# EAGLE schematic Tesla Coil (EAGLE 9.2.1)

## Sheet 1 of 3: Interrupter
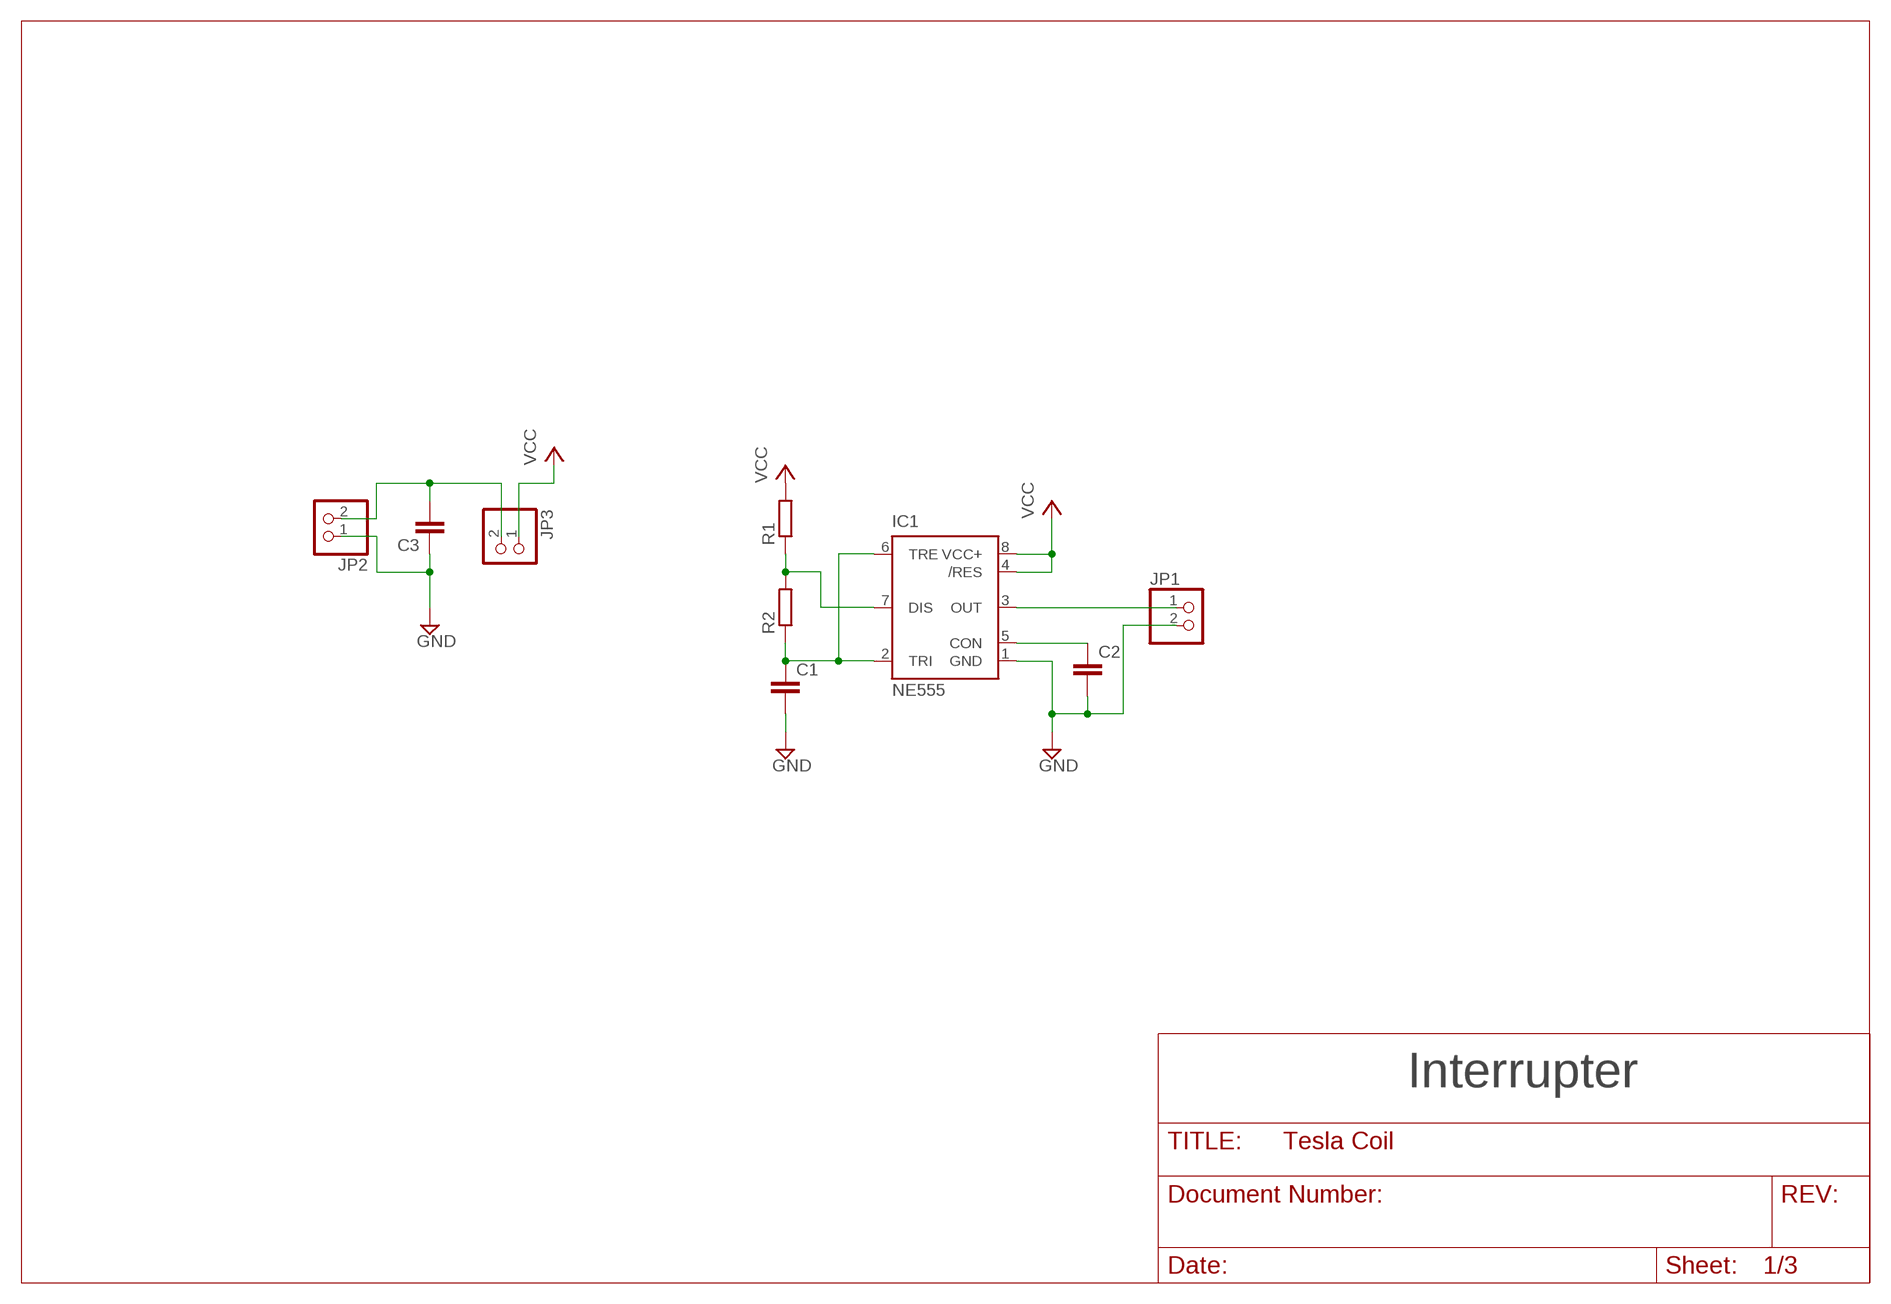
[diagram p0: schematic, sheet 1]

### Parts
C1  C-EUC0603  [C0603]
C2  C-EUC0603  [C0603]
C3  C-EUC0603  [C0603]
IC1  NE555  [DIL-08]
JP1  PINHD-1X2  [1X02]
JP2  PINHD-1X2  [1X02]
JP3  PINHD-1X2  [1X02]
R1  R-EU_R0603  [R0603]
R2  R-EU_R0603  [R0603]

### Nets
GND: C1.2 C2.2 C3.1 IC1.1(GND) JP1.2 JP2.1 ; also sheet 2,3
N$1: IC1.7(DIS) R1.1 R2.2
N$2: C1.1 IC1.2(TRI) IC1.6(TRE) R2.1
N$3: C2.1 IC1.5(CON)
N$4: C3.2 JP2.2 JP3.2
N$5: IC1.3(OUT) JP1.1
VCC: IC1.4(/RES) IC1.8(VCC+) JP3.1 R1.2 ; also sheet 2

### Notes on the sheet
- Interrupter

## Sheet 2 of 3: Driver
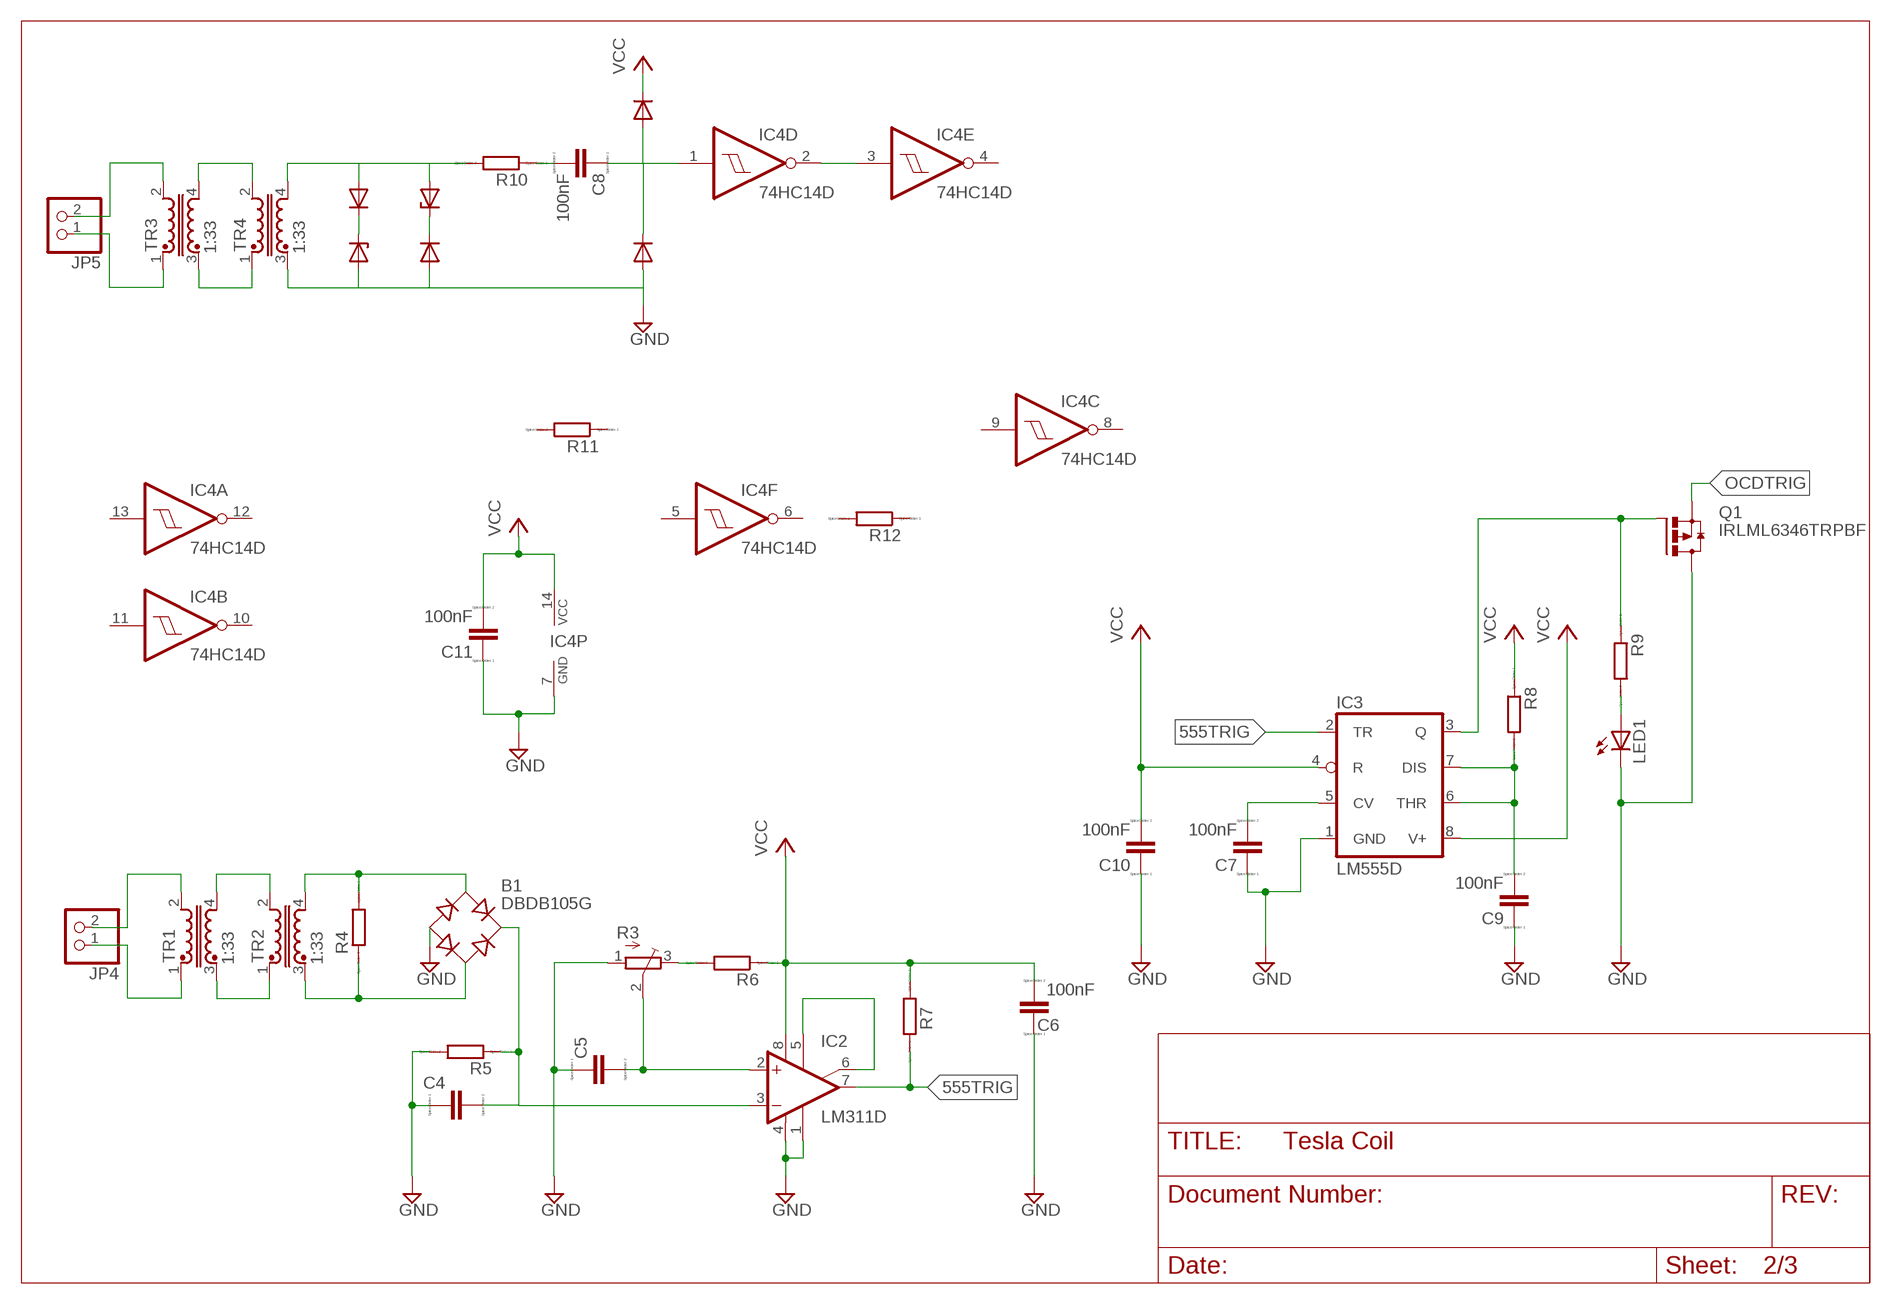
[diagram p1: schematic, sheet 2]

### Parts
B1  DBDB105G  [DB]
C4  CC0603  [C0603]
C5  CC0603  [C0603]
C6  100nF  CC0603  [C0603]
C7  100nF  CC0603  [C0603]
C8  100nF  CC0603  [C0603]
C9  100nF  CC0603  [C0603]
C10  100nF  CC0603  [C0603]
C11  100nF  CC0603  [C0603]
IC2  LM311D  [SO08]
IC3  LM555D  [SO08]
IC4  74HC14D  [SO14]
JP4  PINHD-1X2  [1X02]
JP5  PINHD-1X2  [1X02]
LED1  LEDCHIP-LED0603  [CHIP-LED0603]
Q1  IRLML6346TRPBF  FDN360P  [SUPER-SOT3]
R3  TRIM_EU-3223G  [3223G]
R4  RR0603  [R0603]
R5  RR0603  [R0603]
R6  RR0603  [R0603]
R7  RR0603  [R0603]
R8  RR0603  [R0603]
R9  RR0603  [R0603]
R10  RR0603  [R0603]
R11  RR0603  [R0603]
R12  RR0603  [R0603]
TR1  1:33  U15-TRANSFORMER  [U15]
TR2  1:33  U15-TRANSFORMER  [U15]
TR3  1:33  U15-TRANSFORMER  [U15]
TR4  1:33  U15-TRANSFORMER  [U15]

### Nets
555TRIG: IC2.7(OUT) R7.2
GND: B1.- C4.1 C5.1 C6.1 C7.1 C9.1 C10.1 C11.1 IC2.1(GND) IC2.4(V-) IC3.1(GND) IC4.7(P:GND) LED1.C Q1.3(D) R3.1(A) R5.2 TR4.3 ; also sheet 1,3
N$6: TR1.4 TR2.2
N$7: TR1.3 TR2.1
N$8: JP4.2 TR1.2
N$9: JP5.2 TR3.2
N$10: JP5.1 TR3.1
N$11: JP4.1 TR1.1
N$12: TR3.4 TR4.2
N$13: TR3.3 TR4.1
N$14: B1.AC1 R4.2 TR2.4
N$15: B1.AC2 R4.1 TR2.3
N$16: IC2.5(ON) IC2.6(ON/STR)
N$17: B1.+ C4.2 IC2.3(-IN) R5.1
N$18: C5.2 IC2.2(+IN) R3.2(S)
N$19: IC3.2(TR)
N$20: R3.3(E) R6.2
N$21: C7.2 IC3.5(CV)
N$22: C9.2 IC3.6(THR) IC3.7(DIS) R8.2
N$23: IC3.3(Q) Q1.1(G) R9.1
N$24: LED1.A R9.2
N$25: R10.2 TR4.4
N$27: C8.1 IC4.1(D:I)
N$29: C8.2 R10.1
N$30: IC4.2(D:O) IC4.3(E:I)
OCDTRIG: Q1.2(S)
VCC: C6.2 C10.2 C11.2 IC2.8(V+) IC3.4(R) IC3.8(V+) IC4.14(P:VCC) R6.1 R7.1 R8.1 ; also sheet 1
Unconnected: IC4.4(E:O) IC4.5(F:I) IC4.6(F:O) IC4.8(C:O) IC4.9(C:I) IC4.10(B:O) IC4.11(B:I) IC4.12(A:O) IC4.13(A:I) R11.1 R11.2 R12.1 R12.2

## Sheet 3 of 3: H-Brug
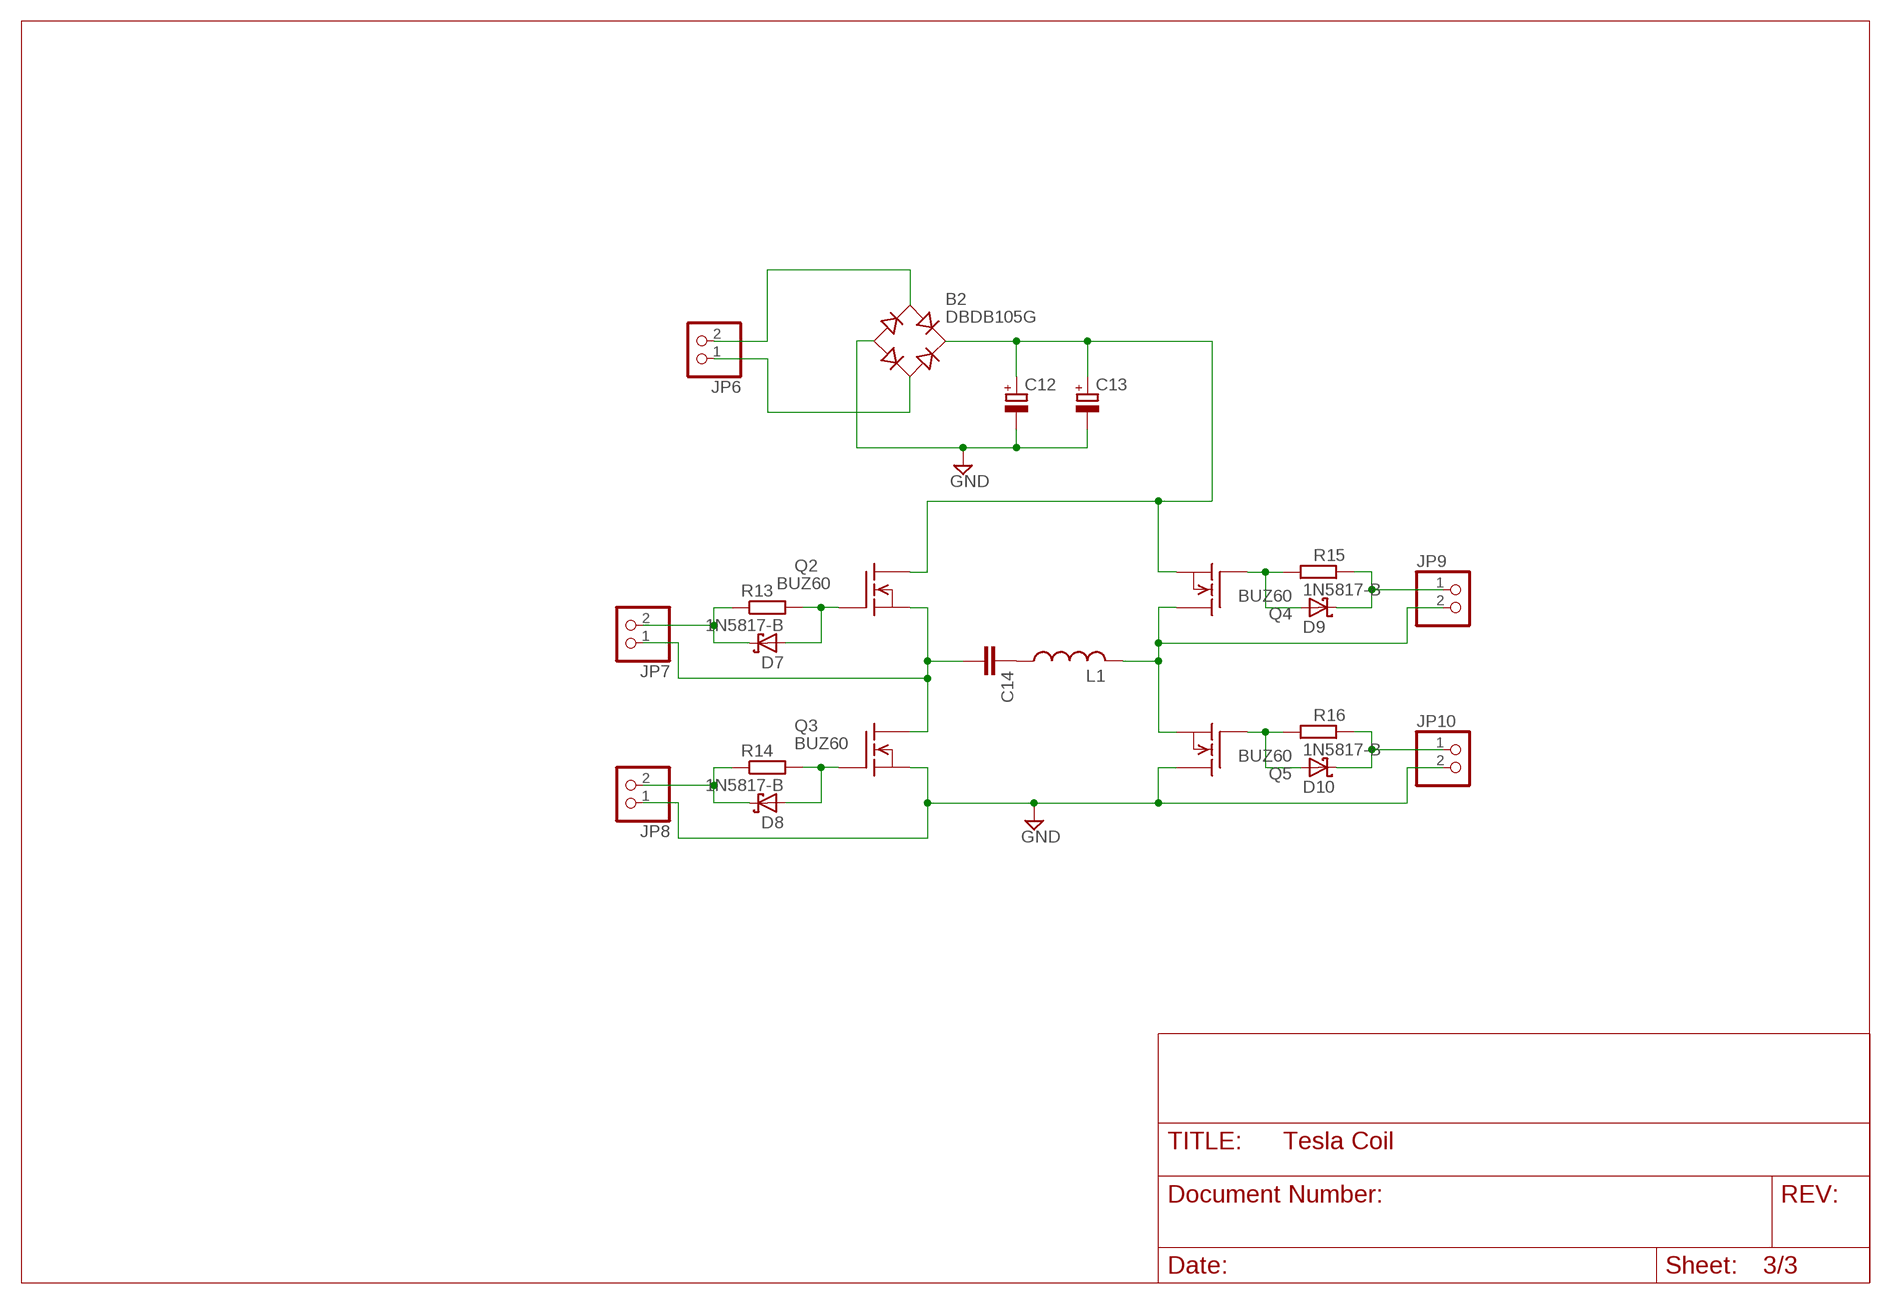
[diagram p2: schematic, sheet 3]

### Parts
B2  DBDB105G  [DB]
C12  CPOL-EUTAP5-45  [TAP5-45]
C13  CPOL-EUTAP5-45  [TAP5-45]
C14  C-EUC0603  [C0603]
D7  1N5817-B  [DO41-7.6]
D8  1N5817-B  [DO41-7.6]
D9  1N5817-B  [DO41-7.6]
D10  1N5817-B  [DO41-7.6]
JP6  PINHD-1X2  [1X02]
JP7  PINHD-1X2  [1X02]
JP8  PINHD-1X2  [1X02]
JP9  PINHD-1X2  [1X02]
JP10  PINHD-1X2  [1X02]
L1  L-USL3216C  [L3216C]
Q2  BUZ60  [TO220]
Q3  BUZ60  [TO220]
Q4  BUZ60  [TO220]
Q5  BUZ60  [TO220]
R13  R-EU_R0805  [R0805]
R14  R-EU_R0805  [R0805]
R15  R-EU_R0805  [R0805]
R16  R-EU_R0805  [R0805]

### Nets
GDT1+: D7.C JP7.2 R13.1
GDT1-: C14.2 JP7.1 Q2.3(S) Q3.2(D)
GDT2-: D8.C JP8.2 R14.1
GDT3+: JP9.2 L1.2 Q4.2(D) Q5.3(S)
GDT3-: D9.C JP9.1 R15.1
GDT4+: D10.C JP10.1 R16.1
GND: B2.- C12.- C13.- JP8.1 JP10.2 Q3.3(S) Q5.2(D) ; also sheet 1,2
N$31: B2.AC1 JP6.2
N$32: B2.AC2 JP6.1
N$33: B2.+ C12.+ C13.+ Q2.2(D) Q4.3(S)
N$35: D9.A Q4.1(G) R15.2
N$37: C14.1 L1.1
N$38: Q2.1(G) R13.2
N$40: D7.A
N$41: D8.A Q3.1(G) R14.2
N$42: D10.A Q5.1(G) R16.2

## Library data of the parts
B1 B2 = rectifier:DB?*G: Single Phase 1.0 AMP Glass Passivated Bridge Rectifier Taiwan Semiconductor Co.,Ltd. - TSC Source: http://www.taiwansemi.com/TSCbig5/ezcatfiles/cust/img/img/db101g.pdf http://www.ts.com.tw/db/pictures/modules/PDT/PDT060207001/DBLS201G.pdf
C1-C3 C14 = resistor:C-EU: CAPACITOR, European symbol
C4-C11 = eagle-ltspice:C: CAPACITOR, European symbol; SPICEMODEL: NONE; SPICEPREFIX: C
C12 C13 = resistor:CPOL-EU: POLARIZED CAPACITOR, European symbol
D7-D10 = diode:1N581*: 1.0A SCHOTTKY BARRIER RECTIFIER Source: http://www.diodes.com/datasheets/ds23001.pdf
IC1 = st-microelectronics:NE555: General purpose bipolar Timer; MF: Arrow Electronics; MPN: NE555N; OC_FARNELL: 1467742; OC_NEWARK: 89K1486
IC2 = linear:LM311: COMPARATOR
IC3 = linear:*555: TIMER
IC4 = 74xx-eu:74*14: Hex schmitt trigger INVERTER
JP1-JP10 = pinhead:PINHD-1X2: PIN HEADER
L1 = resistor:L-US: INDUCTOR, American symbol
LED1 = led:LED: LED OSRAM: - CHIPLED LG R971, LG N971, LY N971, LG Q971, LY Q971, LO R971, LY R971 LH N974, LH R974 LS Q976, LO Q976, LY Q976 LO Q996 - Hyper CHIPLED LW Q18S LB Q993, LB Q99A, LB R99A - SideLED LS A670, LO A670, LY A670, LG A670, LP A670 LB A673, LV A673, LT A673, LW A673 LH A674 LY A675 LS A676, LA A676, LO A676, LY A676, LW A676 LS A679, LY A679, LG A679 - Hyper Micro SIDELED® LS Y876, LA Y876, LO Y876, LY Y876 LT Y87S - SmartLED LW L88C, LW L88S LB L89C, LB L89S, LG L890 LS L89K, LO L89K, LY L89K LS L896, LA L896, LO L896, LY L896 - TOPLED LS T670, LO T670, LY T670, LG T670, LP T670 LSG T670, LSP T670, LSY T670, LOP T670, LYG T670 LG T671, LOG T671, LSG T671 LB T673, LV T673, LT T673, LW T673 LH T674 LS T676, LA T676, LO T676, LY T676, LB T676, LH T676, LSB T676, LW T676 LB T67C, LV T67C, LT T67C, LS T67K, LO T67K, LY T67K, LW E67C LS E67B, LA E67B, LO E67B, LY E67B, LB E67C, LV E67C, LT E67C LW T67C LS T679, LY T679, LG T679 LS T770, LO T770, LY T770, LG T770, LP T770 LB T773, LV T773, LT T773, LW T773 LH T774 LS E675, LA E675, LY E675, LS T675 LS T776, LA T776, LO T776, LY T776, LB T776 LHGB T686 LT T68C, LB T68C - Hyper Mini TOPLED® LB M676 - Mini TOPLED Santana® LG M470 LS M47K, LO M47K, LY M47K Source: http://www.osram.convergy.de LUXEON: - LUMILED® LXK2-PW12-R00, LXK2-PW12-S00, LXK2-PW14-U00, LXK2-PW14-V00 LXK2-PM12-R00, LXK2-PM12-S00, LXK2-PM14-U00 LXK2-PE12-Q00, LXK2-PE12-R00, LXK2-PE12-S00, LXK2-PE14-T00, LXK2-PE14-U00 LXK2-PB12-K00, LXK2-PB12-L00, LXK2-PB12-M00, LXK2-PB14-N00, LXK2-PB14-P00, LXK2-PB14-Q00 LXK2-PR12-L00, LXK2-PR12-M00, LXK2-PR14-Q00, LXK2-PR14-R00 LXK2-PD12-Q00, LXK2-PD12-R00, LXK2-PD12-S00 LXK2-PH12-R00, LXK2-PH12-S00 LXK2-PL12-P00, LXK2-PL12-Q00, LXK2-PL12-R00 Source: www.luxeon.com KINGBRIGHT: KA-3528ASYC Source: www.kingbright.com
Q1 = transistor-power:FDN360P: Single P-Channel, PowerTrench (R) MOSFET Source: http://www.fairchildsemi.com/ds/FD/FDN360P.pdf
Q2-Q5 = transistor-fet:BUZ60: N-Channel Enhancement MOSFET 400V; 5,5A; 1,0Ohm
R1 R2 = rcl:R-EU_: RESISTOR, European symbol; SPICEPREFIX: R
R3 = pot:TRIM_EU-: POTENTIOMETER
R4-R12 = eagle-ltspice:R: RESISTOR, European symbol; SPICEMODEL: NONE; SPICEPREFIX: R
R13-R16 = resistor:R-EU_: RESISTOR, European symbol
TR1-TR4 = inductor-neosid:U15: TRANSFORMER U15; OC_FARNELL: unknown; OC_NEWARK: unknown